# EasyEDA Pro project JLINK-OB下载器.eprj

# Schematic Schematic1_1
Create Date: 2023-09-08; Page Name: P1; Project Name: JLINK-OB下载器; Schematic Name: Schematic1; Update Date: 2023-09-08; Company: 嘉立创EDA; Page Size: A4; Version: V1.0
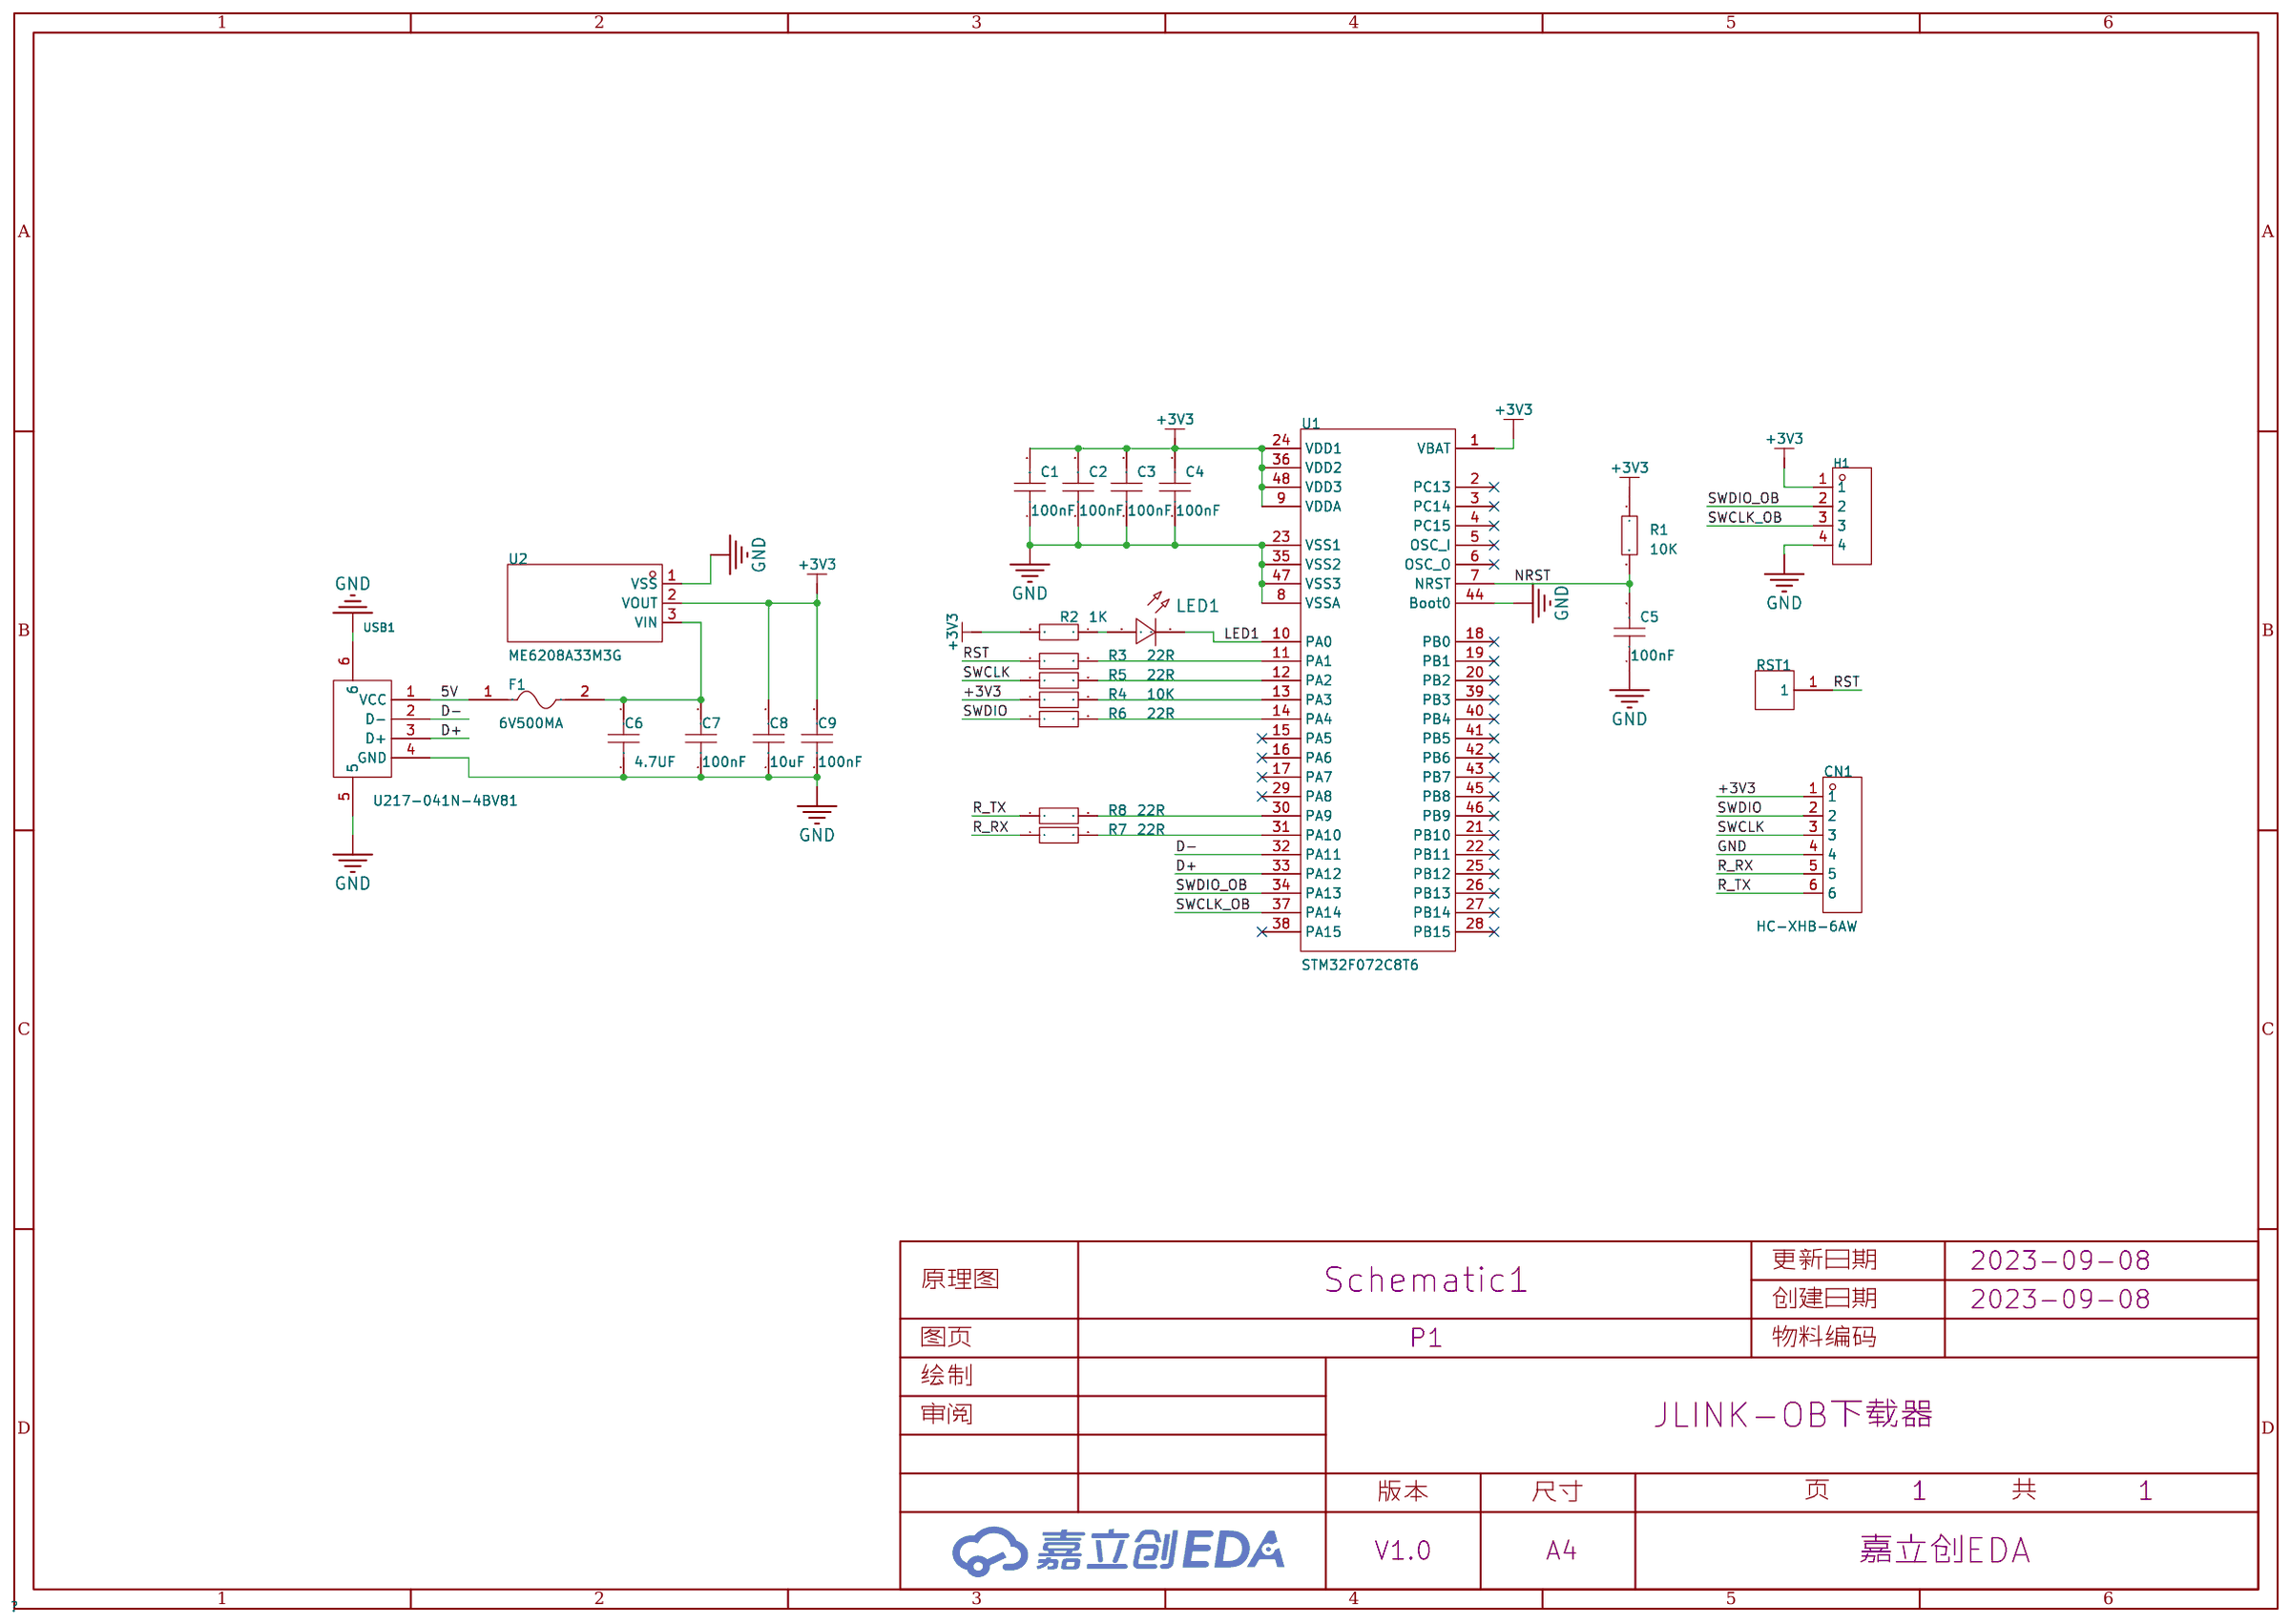
[diagram p0: schematic sheet]

## Parts
C1  100nF  [C0603]
C2  100nF  [C0603]
C3  100nF  [C0603]
C4  100nF  [C0603]
C5  100nF  [C0603]
C6  4.7UF  [C0603]
C7  100nF  [C0603]
C8  10uF  [C0603]
C9  100nF  [C0603]
CN1  HC-XHB-6AW  [CONN-TH_6P-P2.50_HCTL_HC-XHB-6AW]
F1  6V500MA  [F0805]
H1  -  [HDR-TH_4P-P2.54-V-F]
LED1  -  [LED_0603]
R1  10K  [R0603]
R2  1K  [R0603]
R3  22R  [R0603]
R4  10K  [R0603]
R5  22R  [R0603]
R6  22R  [R0603]
R7  22R  [R0603]
R8  22R  [R0603]
RST1  -  [PAD_1.5*1.5MM]
U1  STM32F072C8T6  [LQFP-48_L7.0-W7.0-P0.50-LS9.0-BL]
U2  ME6208A33M3G  [SOT-23-3_L2.9-W1.3-P1.90-LS2.4-BR]
USB1  U217-041N-4BV81  [USB-A-SMD_U217-041N-4BV81]

## Library data of the parts
C1-C9 = CAP_0603: Supplier Footprint: 0603
CN1 = HC-XHB-6AW: 参考系列:-;间距:2.5mm;插针结构:1x6P;排数:1;每排PIN数:6;行距:-;公母:公型插针;安装方式:弯插;额定电流:3A;工作温度范围:-25℃~+85℃;; LCSC Part Name: 2.54带锁扣卧式插件 6P 针座连接器线对板/线对线连接器; Supplier Part: C2845509; Manufacturer: HCTL(华灿天禄); Supplier Footprint: 弯插,P=2.5mm; JLCPCB Part Class: Extended Part; Datasheet: https://atta.szlcsc.com/upload/public/pdf/source/20210729/C2845505_EFBF7AEAA36C6A5A1E79F7933436620E.pdf; Supplier: LCSC; Pitch: 2.5mm; Pins Structure: 1x6P; Number of Rows: 1; Number of PINs Per Row: 6; Gender: 公型插针; Mounting Style: 弯插; Current Rating (Max): 3A; Operating Temperature Range: -25℃~+85℃
F1 = SMD0805-010-24V: 最大电压:24V;最大电流:100A;保持电流:100mA;跳闸电流:300mA;; LCSC Part Name: 24V 100mA 0805自恢复; Supplier Part: C70055; Manufacturer: 台湾陆海; Supplier Footprint: 0805; JLCPCB Part Class: Extended Part; Datasheet: https://atta.szlcsc.com/upload/public/pdf/source/20230404/065DFBBD97B50047427C65C19D90EC24.pdf; Supplier: LCSC; Operating Voltage (Max): 24V; Current Rating (Max): 100A; Hold Current: 100mA; Trip Current: 300mA
H1 = HDR-F_2.54_1x4P: Supplier Part: C2718488; Supplier Footprint: 插件
LED1 = LED_0603-R: Supplier Footprint: 0603
R1-R8 = Res_0603: Supplier Footprint: 0603
RST1 = 测试点1.5x1.5mm
U1 = STM32F072C8T6: Supplier Part: C80488; Manufacturer: ST(意法半导体); Supplier Footprint: LQFP-48(7x7); JLCPCB Part Class: Extended Part; Datasheet: https://atta.szlcsc.com/upload/public/pdf/source/20160816/1471343013459.pdf; Supplier: LCSC
U2 = ME6208A33M3G: 输出类型:固定;输出极性:正;最大输入电压:18V;输出电压:3.3V;输出电流:200mA;电源纹波抑制比(PSRR):-;; LCSC Part Name: 输入18V 输出3.3V 200mA; Supplier Part: C235314; Manufacturer: MICRONE(南京微盟); Supplier Footprint: SOT-23; JLCPCB Part Class: Extended Part; Datasheet: https://atta.szlcsc.com/upload/public/pdf/source/20180719/C235314_F2180C808F252B997125710FED69CC70.pdf; Supplier: LCSC; Output Type: 固定; Output Polarity: 正; Number of Outputs: 1; Maximum Input Voltage: 18V; Output Voltage: 3.3V; Dropout Voltage: 1V@(200mA); Output Current: 200mA
USB1 = U217-041N-4BV81: 连接器类型:Type-A;标准:USB 2.0;公母:公头;触点数量:4P;端口数量:1;安装方式:沉板;额定电流 - 电源:1.5A;触头材质:黄铜;触头镀层:金;工作温度范围:-40℃~+85℃;焊接温度(最大值):260℃;; LCSC Part Name: Type-A 公头 沉板; Supplier Part: C319178; Manufacturer: XKB Connectivity(中国星坤); Supplier Footprint: SMD; JLCPCB Part Class: Extended Part; Datasheet: https://atta.szlcsc.com/upload/public/pdf/source/20211015/D42E73CBE112FBE216C7DAC502068881.pdf; Supplier: LCSC; Connector Type: Type-A; Standard: USB 2.0; Gender: 公头; Number of Contacts: 4P; Number of Ports: 1; Mounting Style: 沉板; Current Rating - Power (Max): 1.5A; Contact Material: 黄铜; Contact Plating: 金; Operating Temperature Range: -40℃~+85℃; Welding Temperature (Max): 260℃

## Nets
5V: F1.1 USB1.1(VCC)
+3V3: C1.2 C2.2 C3.2 C4.2 C8.2 C9.2 CN1.1 H1.1 R1.1 R2.2 R4.1 U1.1(VBAT) U1.9(VDDA) U1.24(VDD1) U1.36(VDD2) U1.48(VDD3) U2.2(VOUT)
GND: C1.1 C2.1 C3.1 C4.1 C5.1 C6.1 C7.1 C8.1 C9.1 CN1.4 H1.4 U1.8(VSSA) U1.23(VSS1) U1.35(VSS2) U1.44(Boot0) U1.47(VSS3) U2.1(VSS) USB1.4(GND) USB1.5 USB1.6
D+: U1.33(PA12) USB1.3(D+)
D-: U1.32(PA11) USB1.2(D-)
LED1: LED1.1(C) U1.10(PA0)
NRST: C5.2 R1.2 U1.7(NRST)
R_RX: CN1.5 R7.1
R_TX: CN1.6 R8.1
RST: R3.1 RST1.1
SWCLK: CN1.3 R5.1
SWCLK_OB: H1.3 U1.37(PA14)
SWDIO: CN1.2 R6.1
SWDIO_OB: H1.2 U1.34(PA13)
$1N630: C6.2 C7.2 F1.2 U2.3(VIN)
$1N1469: R7.2 U1.31(PA10)
$1N1470: R8.2 U1.30(PA9)
$1N1807: R3.2 U1.11(PA1)
$1N1810: R5.2 U1.12(PA2)
$1N1813: R4.2 U1.13(PA3)
$1N1816: R6.2 U1.14(PA4)
Net-(LED1-2): LED1.2(A) R2.1

Not connected (* = marked no-connect by the designer): U1 2(PC13)* 3(PC14)* 4(PC15)* 5(OSC_I)* 6(OSC_O)* 15(PA5)* 16(PA6)* 17(PA7)* 18(PB0)* 19(PB1)* 20(PB2)* 21(PB10)* 22(PB11)* 25(PB12)* 26(PB13)* 27(PB14)* 28(PB15)* 29(PA8)* 38(PA15)* 39(PB3)* 40(PB4)* 41(PB5)* 42(PB6)* 43(PB7)* 45(PB8)* 46(PB9)*

# Board PCB1_1
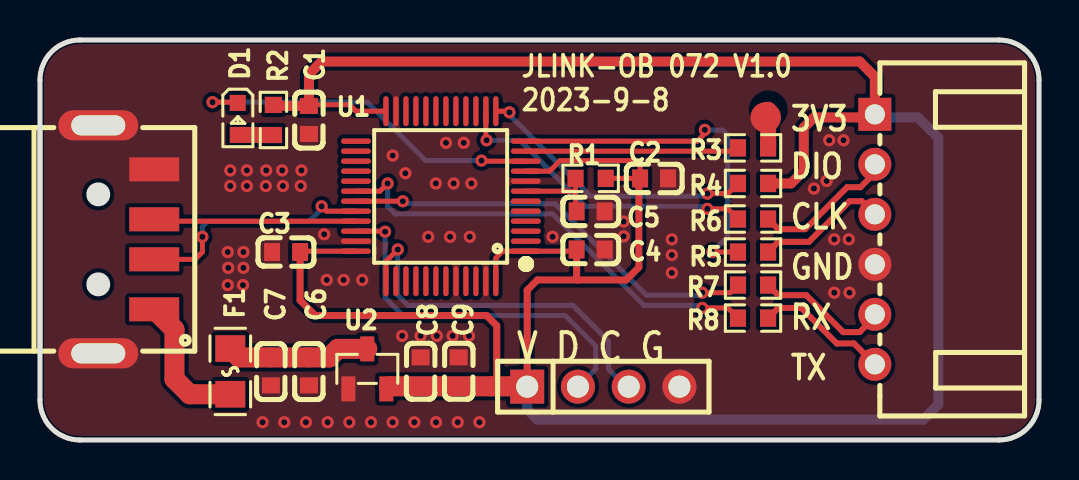
[diagram p1: board, top side]
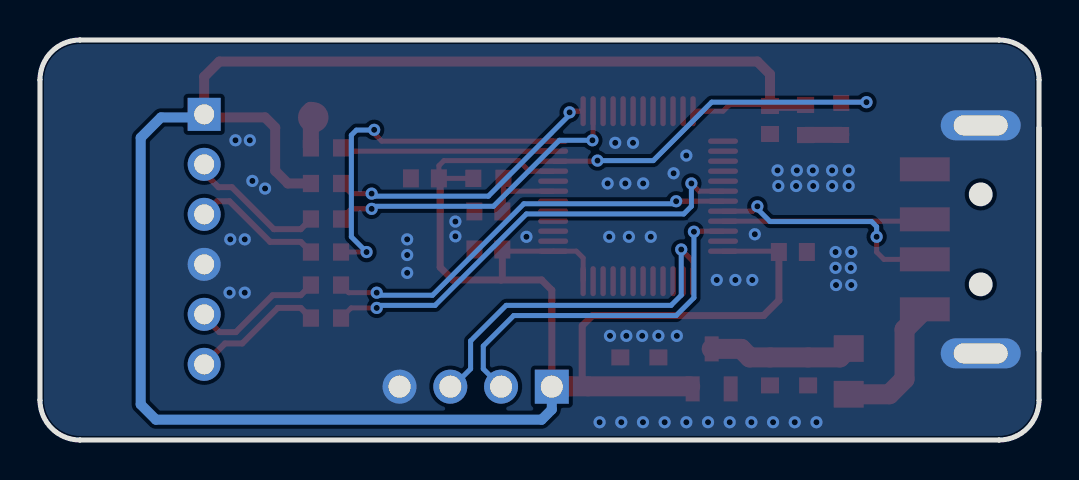
[diagram p2: board, bottom side, seen from below]

Outline 50 x 20 mm; copper layers: Top Layer, Bottom Layer. Coordinates in mm from the lower left corner of the outline.
Outline path: 0,18 0,2 arc(0.59,0.59) 2,0 48,0 arc(49.41,0.59) 50,2 50,18 arc(49.41,19.41) 48,20 2,20 arc(0.59,19.41) 0,18
Stack: Top Layer 0.035mm / Dielectric1 1.51mm FR4 er 4.5 / Bottom Layer 0.035mm

## Design rules (mm)
template: 自定义配置
spacing copperThickness1oz (default): track to track 0.102, other pairs 0.152 to 0.3
spacing copperThickness2oz: track to track 0.203, other pairs 0.152 to 0.3
track width copperThickness1oz (default): min 0.127, default 0.254, max 2.54
track width copperThickness2oz: min 0.203, default 0.254, max 2.54
differential pair differentialPair (default): width min 0.127, default 0.254, max 2.54; gap min 0.152, default 0.152
via viaSize (default): diameter min 0.5, default 0.61, max 10; hole min 0.3, default 0.305, max 6.3

## Placement (name value [footprint] x y rotation side)
C1  100nF  [C0603]  13.46 16 90 top
C2  100nF  [C0603]  30.73 13.08 180 top
C3  100nF  [C0603]  12.32 9.4 0 top
C4  100nF  [C0603]  27.56 9.52 180 top
C5  100nF  [C0603]  27.56 11.43 180 top
C6  4.7UF  [C0603]  13.46 3.43 90 top
C7  100nF  [C0603]  11.56 3.43 90 top
C8  10uF  [C0603]  19.05 3.43 270 top
C9  100nF  [C0603]  20.95 3.43 270 top
CN1  HC-XHB-6AW  [CONN-TH_6P-P2.50_HCTL_HC-XHB-6AW]  41.78 10.03 90 top
D1  -  [LED_0603]  9.91 16 270 top
F1  6V500MA  [F0805]  9.52 3.43 90 top
H1  -  [HDR-TH_4P-P2.54-V-F]  28.19 2.67 0 top
R1  10K  [R0603]  27.56 13.08 180 top
R2  1K  [R0603]  11.68 16 90 top
R3  22R  [R0603]  35.69 14.6 180 top
R4  10K  [R0603]  35.69 12.83 180 top
R5  22R  [R0603]  35.69 9.4 180 top
R6  22R  [R0603]  35.69 11.05 180 top
R7  22R  [R0603]  35.69 7.75 180 top
R8  22R  [R0603]  35.69 6.1 180 top
RST  -  [PAD_1.5*1.5MM]  36.45 16.51 0 top
U1  STM32F072C8T6  [LQFP-48_L7.0-W7.0-P0.50-LS9.0-BL]  20.07 12.19 90 top
U2  ME6208A33M3G  [SOT-23-3_L2.9-W1.3-P1.90-LS2.4-BR]  16.38 3.56 270 top
USB1  U217-041N-4BV81  [USB-A-SMD_U217-041N-4BV81]  4.32 10.03 270 top

## Footprints (pads in the part's own frame, mm; a bottom-side part is the same pattern mirrored in y, then rotated)
C0603
  rect 0.8x0.9 smd: 1(-0.7,0) 2(0.7,0)
CONN-TH_6P-P2.50_HCTL_HC-XHB-6AW
  rect 1.65x1.65 hole 1: 1(6.25,0)
  round 1.65 hole 1: 2(3.75,0) 3(1.25,0) 4(-1.25,0) 5(-3.75,0) 6(-6.25,0)
F0805
  rect 1.335x1.5 smd: 1(-1.143,0) 2(1.143,0)
HDR-TH_4P-P2.54-V-F
  rect 1.7x1.7 hole 1.1: 1(-3.81,0)
  round 1.7 hole 1.1: 2(-1.27,0) 3(1.27,0) 4(3.81,0)
LED_0603
  rect 0.8x0.8 smd: 1(-0.851,-0.01) 2(0.75,-0.005)
LQFP-48_L7.0-W7.0-P0.50-LS9.0-BL
  oval 0.27x1.5 smd: 1(-2.75,-4.25) 2(-2.25,-4.25) 3(-1.75,-4.25) 4(-1.25,-4.25) 5(-0.75,-4.25) 6(-0.25,-4.25) 7(0.25,-4.25) 8(0.75,-4.25) 9(1.25,-4.25) 10(1.75,-4.25) 11(2.25,-4.25) 12(2.75,-4.25) 25(2.75,4.25) 26(2.25,4.25) 27(1.75,4.25) 28(1.25,4.25) 29(0.75,4.25) 30(0.25,4.25) 31(-0.25,4.25) 32(-0.75,4.25) 33(-1.25,4.25) 34(-1.75,4.25) 35(-2.25,4.25) 36(-2.75,4.25)
  oval 1.5x0.27 smd: 13(4.25,-2.75) 14(4.25,-2.25) 15(4.25,-1.75) 16(4.25,-1.25) 17(4.25,-0.75) 18(4.25,-0.25) 19(4.25,0.25) 20(4.25,0.75) 21(4.25,1.25) 22(4.25,1.75) 23(4.25,2.25) 24(4.25,2.75) 37(-4.25,2.75) 38(-4.25,2.25) 39(-4.25,1.75) 40(-4.25,1.25) 41(-4.25,0.75) 42(-4.25,0.25) 43(-4.25,-0.25) 44(-4.25,-0.75) 45(-4.25,-1.25) 46(-4.25,-1.75) 47(-4.25,-2.25) 48(-4.25,-2.75)
PAD_1.5*1.5MM
  round 1.524 smd: 1(-0.127,-0.381)
R0603
  rect 0.806x0.864 smd: 1(-0.753,0) 2(0.753,0)
SOT-23-3_L2.9-W1.3-P1.90-LS2.4-BR
  rect 1.25x0.7 smd: 1(1,-0.95) 2(1,0.95) 3(-1,0)
USB-A-SMD_U217-041N-4BV81
  rect 1.2x2.5 smd: 1(3.5,1.4) 2(1,1.4) 3(-1,1.4) 4(-3.5,1.4)
  oval 1.5x4 hole 1x2.7: 5(-5.7,-1.4) 6(5.7,-1.4)

## Nets
As in the schematic, except:
LED1: D1.1 U1.10
RST: R3.1 RST.1
$1N1676: D1.2 R2.1

Pads without a net: U1 2 3 4 5 6 15 16 17 18 19 20 21 22 25 26 27 28 29 38 39 40 41 42 43 45 46

## Via types
v1: diameter 0.61, hole 0.305, Top Layer to Bottom Layer, 76 vias

## Routing (per net, layer and track width the routed paths; a pad name or vN(x,y) marks a point on that pad's centre or on a via; arc(x,y) is an arc through that point)
5V: length 7
  Top Layer w1: F1.1 7.49,2.29 6.73,3.05 6.73,5.52 USB1.1
+3V3: length 141.6
  Top Layer w0.25: U1.36 13.06,9.44 C3.2 ; U1.48 22.82,9.1 23.16,9.44 U1.1 26.78,9.44 C4.2 ; U1.9 25.51,13.44 26.03,13.97 29.78,13.97 30.03,13.72 C2.2 R1.1 ; C1.2 13.52,16.76 15.49,16.76 15.82,16.44 U1.24
  Top Layer w0.35: 22.57,2.68 22.86,2.97 22.86,5.71 22.35,6.22 13.78,6.22 13.02,6.98 C3.2 ; 26.92,8 29.34,8 29.97,8.64 29.97,13.02 C2.2 ; 26.92,8 24.89,8 24.38,7.49 H1.1 ; 26.92,8 26.86,8.06 C4.2
  Top Layer w0.5: R4.1 37.59,12.83 38.23,13.46 38.23,15.62 38.73,16.13 41.63,16.13 CN1.1 41.78,18.16 41.02,18.92 14.1,18.92 13.46,18.29 C1.2 11.74,16.7 R2.2
  Top Layer w1: 24.13,2.67 24.11,2.68 17.46,2.68
  Bottom Layer w0.5: CN1.1 41.94,16.13 43.94,16.13 44.96,15.11 44.96,1.78 44.2,1.02 24.89,1.02 24.38,1.52 H1.1
GND:
  vias: v1(9.4,9.4) v1(9.42,8.61) v1(9.4,7.75) v1(9.52,13.48) v1(9.52,12.7) v1(10.16,7.75) v1(10.18,9.4) v1(10.18,8.61) v1(10.36,13.48) v1(10.36,12.7) v1(11.14,0.89) v1(11.32,13.48) v1(11.3,12.7) v1(12.12,13.48) v1(12.16,12.7) v1(12.23,0.89) v1(13.05,12.7) v1(13.09,13.48) v1(13.31,0.89) v1(14.22,10.29) v1(14.35,8) v1(14.4,0.89) v1(15.2,8) v1(15.48,0.89) v1(16.13,8) v1(16.57,0.89) v1(17.65,14.22) v1(17.65,0.89) v1(18.13,5.21) v1(18.29,13.33) v1(18.74,0.89) v1(19.05,5.21) v1(19.43,10.16) v1(19.81,12.83) v1(19.86,5.21) v1(19.82,0.89) v1(20.32,14.86) v1(20.53,10.16) v1(20.65,5.21) v1(20.71,12.83) v1(20.91,0.89) v1(21.21,14.86) v1(21.47,5.21) v1(21.51,10.16) v1(21.59,12.83) v1(21.99,0.89) v1(25.65,10.16) v1(29.21,10.92) v1(29.21,10.18) v1(31.62,10.03) v1(31.62,9.25) v1(31.62,8.36) v1(38.73,12.57) v1(39.37,12.95) v1(39.5,14.99) v1(39.75,10.03) v1(39.75,7.37) v1(40.21,14.99) v1(40.48,10.03) v1(40.51,7.37)
D+: length 10.1
  Top Layer w0.25: USB1.3 5.81,10.94 U1.33
D-: length 12.1
  Top Layer w0.25: v1(8.13,10.16) 8.13,9.4 7.76,9.03 USB1.2 ; U1.32 14.34,11.44 v1(14.1,11.68)
  Bottom Layer w0.25: v1(14.1,11.68) 14.1,11.56 13.46,10.92 8.38,10.92 8.13,10.67 v1(8.13,10.16)
LED1: length 18.2
  Top Layer w0.25: D1.1 9.86,16.89 v1(8.64,16.89) ; U1.10 22.13,13.94 v1(22.1,13.97)
  Bottom Layer w0.25: v1(8.64,16.89) 16.38,16.89 19.3,13.97 v1(22.1,13.97)
NRST: length 4.3
  Top Layer w0.25: R1.2 26.81,12.45 ; 26.81,12.45 26.81,11.49 26.92,11.37 ; 26.81,12.45 26.8,12.44 U1.7
R_RX: length 6.8
  Top Layer w0.3: CN1.5 41.78,6.16 41.02,5.39 40.2,5.39 38.35,7.24 36.95,7.24 R7.1
R_TX: length 6.7
  Top Layer w0.3: CN1.6 40.74,4.83 39.88,4.83 38.1,6.6 36.95,6.6 R8.1
RST: length 1.9
  Top Layer w0.8: R3.1 36.44,16.5 36.45,16.51
SWCLK: length 6.7
  Top Layer w0.3: CN1.3 41.13,11.94 40.51,11.94 38.48,9.91 36.95,9.91 R5.1
SWCLK_OB: length 18.4
  Top Layer w0.25: v1(17.91,9.52) 17.32,8.93 U1.37
  Bottom Layer w0.25: v1(17.91,9.52) 17.91,7.24 18.42,6.73 26.67,6.73 28.45,4.95 28.45,3.56 29.34,2.67 29.46,2.67
SWDIO: length 7.1
  Top Layer w0.3: R6.1 36.95,10.54 38.29,10.54 40.39,12.64 41.06,12.64 41.78,13.36 CN1.2
SWDIO_OB: length 18.7
  Top Layer w0.25: v1(17.27,10.41) 17.24,10.44 U1.34
  Bottom Layer w0.25: v1(17.27,10.41) 17.27,7.11 18.16,6.22 26.29,6.22 27.81,4.7 27.81,3.56 H1.2
$1N630: length 7.2
  Top Layer w1: F1.2 9.97,4.13 C7.2 C6.2 14.48,4.13 14.9,4.56 U2.3
$1N1469: length 21.3
  Top Layer w0.25: v1(33.15,7.37) 34.55,7.37 R7.2 ; v1(18.16,11.94) 18.16,11.94 U1.31
  Bottom Layer w0.25: v1(33.15,7.37) 33.02,7.24 30.35,7.24 25.78,11.81 18.29,11.81 v1(18.16,11.94)
$1N1470: length 22.7
  Top Layer w0.25: v1(17.4,12.83) 17.01,12.44 U1.30 ; R8.2 34.43,6.6 v1(33.15,6.6)
  Bottom Layer w0.25: v1(33.15,6.6) 33.02,6.73 30.23,6.73 25.65,11.3 17.78,11.3 17.4,11.68 v1(17.4,12.83)
$1N1676: length 1.8
  Top Layer w0.8: D1.2 11.68,15.25 R2.1
$1N1807: length 10.7
  Top Layer w0.25: R3.2 34.77,14.44 U1.11
$1N1810: length 18
  Top Layer w0.25: v1(33.27,15.51) 33.27,15.32 32.89,14.94 U1.12 ; v1(33.65,9.4) R5.2
  Bottom Layer w0.25: 33.27,15.49 34.16,15.49 34.42,15.24 34.42,10.16 v1(33.65,9.4)
$1N1813: length 14.2
  Top Layer w0.25: v1(23.49,16.38) 23.44,16.44 U1.13 ; R4.2 34.43,12.32 v1(33.4,12.32)
  Bottom Layer w0.25: v1(33.4,12.32) 33.27,12.19 27.56,12.19 23.49,16.26 v1(23.49,16.38)
$1N1816: length 15.7
  Top Layer w0.25: v1(22.35,14.99) 22.32,15.02 U1.14 ; R6.2 34.43,11.56 v1(33.4,11.56)
  Bottom Layer w0.25: v1(22.35,14.99) 24,14.99 27.3,11.68 33.27,11.68 v1(33.4,11.56)

## Copper pours and planes (outline as drawn; the poured copper is in the pictures)
GND on Top Layer: -1.14,20.83 50.93,20.83 50.93,-0.76 -1.14,-0.76
GND on Bottom Layer: -1.65,21.84 51.94,21.84 51.94,-1.65 -1.65,-1.65

## Text on the board
Top Silkscreen Layer: JLINK-OB 072 V1.0 / 2023-9-8 | 3V3 | DIO | CLK | GND | RX | TX | V D C G
